# Altium project Hydrophones DAQ.PrjPcb (part 1 of 2)
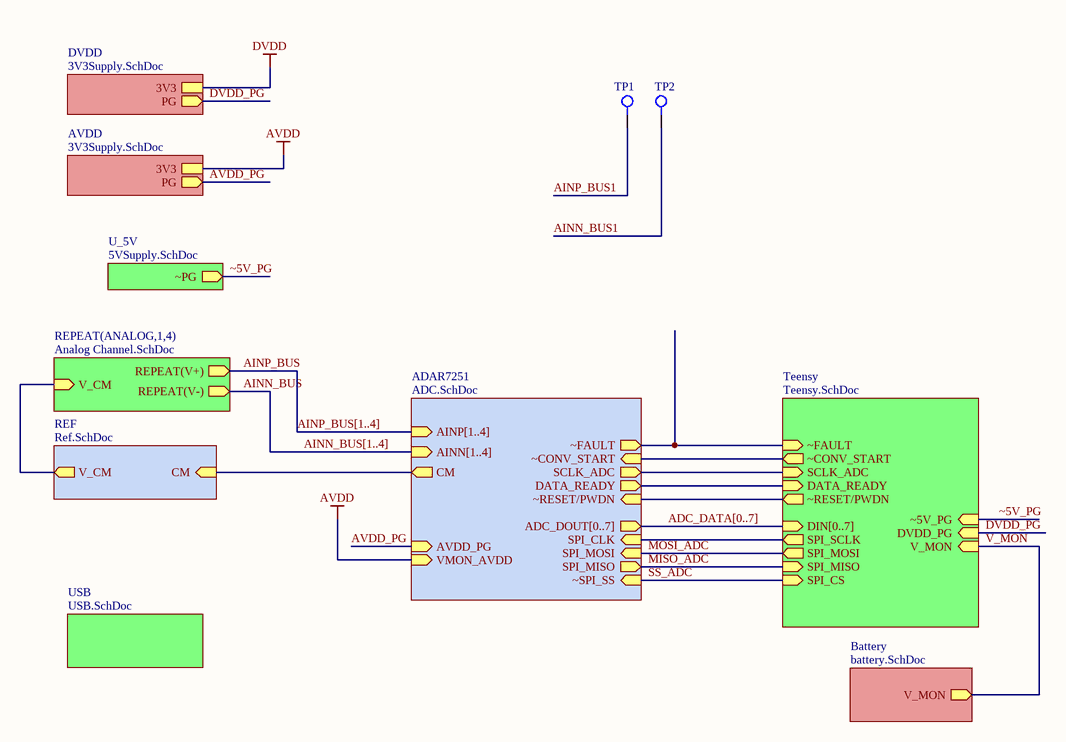
[diagram p0: Top.SchDoc]
10 sheets, 157 parts. Net scope: hierarchical (ports join the sheet entries above them; power ports are global).
Board file: Rev3.PcbDoc
Sheets:
  Top.SchDoc
    ANALOG1 = Analog Channel.SchDoc
    ANALOG2 = Analog Channel.SchDoc
    ANALOG3 = Analog Channel.SchDoc
    ANALOG4 = Analog Channel.SchDoc
    ADAR7251 = ADC.SchDoc
      XTAL = XTAL.SchDoc
    Battery = battery.SchDoc
    REF = Ref.SchDoc
    DVDD = 3V3Supply.SchDoc
    U_5V = 5VSupply.SchDoc
    AVDD = 3V3Supply.SchDoc
    Teensy = Teensy.SchDoc
    USB = USB.SchDoc

## Sheet Top.SchDoc
size A

### Parts
TP1  TP  [TP_5029]  (value not drawn)
TP2  TP  [TP_5029]  (value not drawn)

### Sub-sheets
ADAR7251 = ADC.SchDoc: AINP[1..4] (in), AINN[1..4] (in), CM (out), ADC_DOUT[0..7] (out), ~CONV_START (in), SCLK_ADC (out), ~SPI_SS (in), SPI_MISO (out), ~FAULT (out), DATA_READY (out), SPI_CLK (in), SPI_MOSI (in), ~RESET/PWDN (in), AVDD_PG (in), VMON_AVDD (in)
AVDD = 3V3Supply.SchDoc: 3V3, PG (out)
Battery = battery.SchDoc: V_MON (out)
DVDD = 3V3Supply.SchDoc: 3V3, PG (out)
REF = Ref.SchDoc: CM (in), V_CM (out)
REPEAT(ANALOG,1,4) = Analog Channel.SchDoc: REPEAT(V+) (out), REPEAT(V-) (out), V_CM (in)
Teensy = Teensy.SchDoc: SPI_MISO (in), ~FAULT (in), SCLK_ADC (in), DVDD_PG (in), ~CONV_START (out), DATA_READY (in), SPI_SCLK (out), SPI_MOSI (out), SPI_CS (in), DIN[0..7] (in), ~RESET/PWDN (out), V_MON (in), ~5V_PG (in)
U_5V = 5VSupply.SchDoc: ~PG (out)
USB = USB.SchDoc: no entries

### Nets
AVDD: sheet ADAR7251/VMON_AVDD, sheet AVDD/3V3
V_CM: sheet REPEAT(ANALOG,1,4)/V_CM, sheet REF/V_CM
AINN_BUS: sheet REPEAT(ANALOG,1,4)/REPEAT(V-)
AINN_BUS1: TP2.1
AINP_BUS: sheet REPEAT(ANALOG,1,4)/REPEAT(V+)
AINP_BUS1: TP1.1  [project net AINN1]
AVDD_PG: sheet ADAR7251/AVDD_PG, sheet AVDD/PG
CM: sheet ADAR7251/CM, sheet REF/CM
DATA_READY: sheet ADAR7251/DATA_READY, sheet Teensy/DATA_READY
DVDD_PG: sheet DVDD/PG, sheet Teensy/DVDD_PG
MISO_ADC: sheet ADAR7251/SPI_MISO, sheet Teensy/SPI_MISO
MOSI_ADC: sheet ADAR7251/SPI_MOSI, sheet Teensy/SPI_MOSI
SCLK_ADC: sheet ADAR7251/SCLK_ADC, sheet Teensy/SCLK_ADC
SPI_CLK: sheet ADAR7251/SPI_CLK, sheet Teensy/SPI_SCLK
SS_ADC: sheet ADAR7251/~SPI_SS, sheet Teensy/SPI_CS  [project net SPI_CS]
V_MON: sheet Battery/V_MON, sheet Teensy/V_MON
~5V_PG: sheet U_5V/~PG, sheet Teensy/~5V_PG
~CONV_START: sheet ADAR7251/~CONV_START, sheet Teensy/~CONV_START
~FAULT: sheet ADAR7251/~FAULT, sheet Teensy/~FAULT
~RESET/PWDN: sheet ADAR7251/~RESET/PWDN, sheet Teensy/~RESET/PWDN

### Buses and harness runs
bus ADC_DATA[0..7] = sheet ADAR7251/ADC_DOUT[0..7] = sheet Teensy/DIN[0..7]
bus AINN_BUS[1..4] = sheet ADAR7251/AINN[1..4]
bus AINP_BUS[1..4] = sheet ADAR7251/AINP[1..4]

### Library data of the parts
TP1 TP2 = TP: 5029 SMD 0805 TP; Supplier 1: Digi-Key; Supplier Part Number 1: 36-5029CT-ND

## Sheet Analog Channel.SchDoc
size A
Used 4 times, as channels ANALOG1, ANALOG2, ANALOG3, ANALOG4. Parts and nets are listed once, with the designators drawn on the sheet.
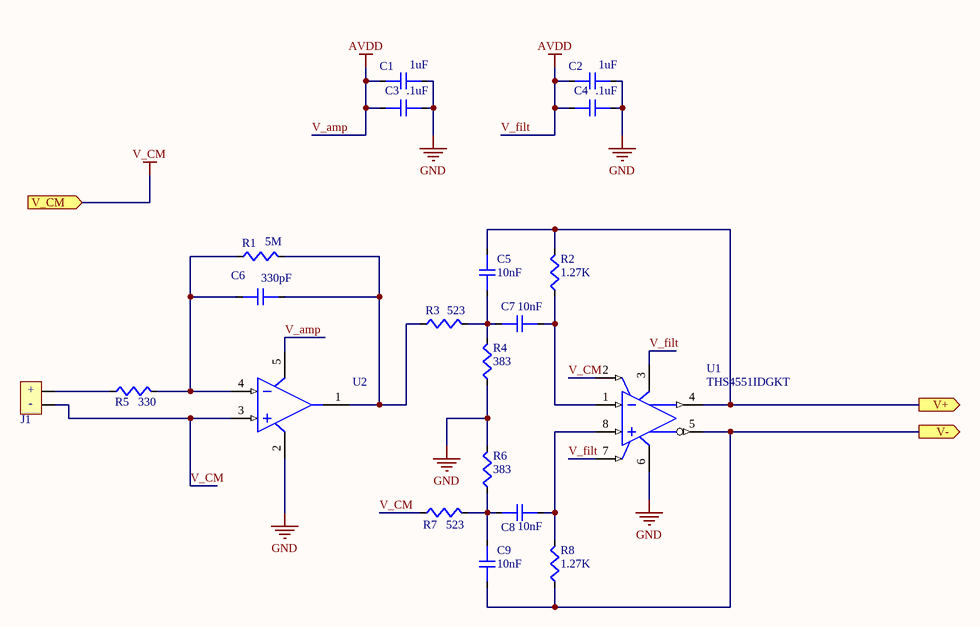
[diagram p1: Analog Channel.SchDoc]

### Parts
C1  1uF  [C0603]
C2  1uF  [C0603]
C3  .1uF  [C0603]
C4  .1uF  [C0603]
C5  10nF  [C0603]
C6  330pF  [C0603]
C7  10nF  [C0603]
C8  10nF  [C0603]
C9  10nF  [C0603]
J1  J  [EPC.00.250.NTN]  (value not drawn)
R1  5M  [R0603]
R2  1.27K  [R0603]
R3  523  [R0603]
R4  383  [R0603]
R5  330  [R0603]
R6  383  [R0603]
R7  523  [R0603]
R8  1.27K  [R0603]
U1  THS4551IDGKT  [8-VSSOP-THS4551]
U2  OPA320  [SOT-23-5]  (value not drawn)

### Ports
V+ (out), V- (out), V_CM (in)

### Nets
GND: C1.1 C2.1 C3.2 C4.2 R4.1 R6.2 U1.6(VS-) U2.2(VS-)
V_amp: C1.2 C2.2 C3.1 C4.1 U1.3(VS+) U1.7(~{PD}) U2.5(VS+)  [also labelled AVDD, V_filt]
V_CM: J1.2 R7.1 U1.2(VOCM) U2.3(+IN) ; port V_CM
V+: C5.2 R2.2 U1.4(VOUT+) ; port V+
V-: C9.1 R8.1 U1.5(VOUT-) ; port V-
NetC5_1: C5.1 C7.1 R3.2 R4.2
NetC6_1: C6.1 R1.1 R5.2 U2.4(-IN)
NetC6_2: C6.2 R1.2 R3.1 U2.1(OUT)
NetC7_2: C7.2 R2.1 U1.1(VIN-)
NetC8_1: C8.1 C9.2 R6.1 R7.2
NetC8_2: C8.2 R8.2 U1.8(VIN+)
NetJ1_1: J1.1 R5.1

### Channels
ANALOG1: designators C1=C3 C2=C29#1 C3=C2 C4=C30#1 C5=C15#1 C6=C1 C7=C25#1 C8=C14#1 C9=C13#1 J1=J1 R1=R5 R2=R25#1 R3=R9#1 R4=R21#1 R5=R1 R6=R13#1 R7=R17#1 R8=R29 U1=U5#1 U2=U1; ports V+=AINN1 V-=AINN_BUS1 V_CM=V_CM
ANALOG2: designators C1=C6 C2=C31 C3=C5 C4=C32 C5=C18#1 C6=C4 C7=C26#1 C8=C17#1 C9=C16#1 J1=J2#1 R1=R6 R2=R26#1 R3=R10#1 R4=R22#1 R5=R2 R6=R14#1 R7=R18#1 R8=R30 U1=U6#1 U2=U2; ports V+=AINN2 V-=AINN_BUS2 V_CM=V_CM
ANALOG3: designators C1=C9 C2=C33#1 C3=C8 C4=C34#1 C5=C21#1 C6=C7 C7=C27#1 C8=C20#1 C9=C19#1 J1=J3#1 R1=R7 R2=R27#1 R3=R11#1 R4=R23#1 R5=R3 R6=R15 R7=R19#1 R8=R31 U1=U7#1 U2=U3; ports V+=AINN3 V-=AINN_BUS3 V_CM=V_CM
ANALOG4: designators C1=C12#1 C2=C35#1 C3=C11#1 C4=C36#1 C5=C24#1 C6=C10#1 C7=C28#1 C8=C23#1 C9=C22#1 J1=J4#1 R1=R8 R2=R28 R3=R12#1 R4=R24#1 R5=R4 R6=R16#1 R7=R20#1 R8=R32 U1=U8#1 U2=U4; ports V+=AINN4 V-=AINN_BUS4 V_CM=V_CM

### Notes on the sheet
- (in symbol hydrophone_connector) +; -

### Library data of the parts
C1 C2 = CL10B105KO8NNNC: Cap Ceramic 1uF 16V X7R 10% SMD 0603 125C T/R; Manufacturer 1: Samsung; Supplier 1: Digi-Key; Supplier Part Number 1: 1276-1019-1-ND; Manufacturer Part Number 1: CL10B105KO8NNNC; Stock 1: 4048324; Pricing 1: 1=0.10000, 10=0.04800, 100=0.02120, 500=0.01516, 1000=0.01192 (USD); RoHS: Yes; Mount: Surface Mount; Case/Package: 0603; Case Code (Metric): 1608; Case Code (Imperial): 0603; Material: Ceramic; Min Operating Temperature: -55°C; Max Operating Temperature: 125°C; Packaging: Tape and Reel; Tolerance: 10%; Capacitance: 1uF; Voltage Rating: 16V; Dielectric: X7R; Voltage: 16V; Voltage Rating (DC): 16V; Length: 1.6mm; Height: 0.8mm; Width: 0.031inch; Thickness: 0.035inch; Depth: 0.8mm; Radiation Hardening: No; Lead Free: Lead Free; ComponentLink1URL: https://datasheet.ciiva.com/15195/getdatasheetpartid-357418-15195728.pdf?src-supplier=Verical; ComponentLink1Description: https://datasheet.ciiva.com/15195/getdatasheetpartid-357418-15195728.pdf?src-supplier=Verical; ComponentLink2URL: https://datasheet.ciiva.com/29198/458176-da-01-en-vs-kondensator-0603-29198478.pdf?src-supplier=Conrad; ComponentLink2Description: https://datasheet.ciiva.com/29198/458176-da-01-en-vs-kondensator-0603-29198478.pdf?src-supplier=Conrad
C3 C4 = VJ0603Y104JXJCW1BC: 0603 0.1 uF 16 V ±5 % Tolerance X7R SMT Multilayer Ceramic Chip Capacitor; Manufacturer 1: Vishay Vitramon; Dielectric Material: Tantalum; Tolerance: 5%; Capacitance: 100nF; Voltage Rating: 16V; Supplier 1: Digi-Key; Supplier Part Number 1: 720-1685-1-ND; Manufacturer Part Number 1: VJ0603Y104JXJCW1BC; Stock 1: 6936; Pricing 1: 1=0.20000, 10=0.13400, 100=0.06780, 500=0.04636, 1000=0.04101 (USD); RoHS: Yes; Mount: Surface Mount; Case/Package: 0603; Number of Pins: 2; Case Code (Imperial): 0603; Case Code (Metric): 1608; Contact Plating: Tin,Matte; Min Operating Temperature: -55°C; Max Operating Temperature: 125°C; Packaging: Tape and Reel; Voltage Rating (DC): 16V; Package Quantity: 4000; Dielectric: X7R; Termination: SMD/SMT; Length: 1.6mm; Height: 0.95mm; Width: 0.8mm; Depth: 0.8mm; Lead Free: Lead Free; ComponentLink1URL: https://datasheet.ciiva.com/5424/vjw1bcbascomseries-223529-5424533.pdf?src-supplier=Mouser; ComponentLink1Description: https://datasheet.ciiva.com/5424/vjw1bcbascomseries-223529-5424533.pdf?src-supplier=Mouser; ComponentLink2URL: https://datasheet.ciiva.com/11491/vjw1bcbascomseries-11491768.pdf?src-supplier=Avnet; ComponentLink2Description: https://datasheet.ciiva.com/11491/vjw1bcbascomseries-11491768.pdf?src-supplier=Avnet; ComponentLink3URL: https://datasheet.ciiva.com/16215/vjw1bcbascomseries-16215161.pdf?src-supplier=Future+Electronics; ComponentLink3Description: https://datasheet.ciiva.com/16215/vjw1bcbascomseries-16215161.pdf?src-supplier=Future+Electronics
C5 C7-C9 = C0603X103F3GACAUTO: CAP CER 10000PF 25V C0G/NP0 0603; Manufacturer 1: Murata; Manufacturer Part Number 1: GRM155R71A104JA01D; Capacitance: 100nF; Tolerance: 5%; Voltage Rating: 10V; Dielectric: X7R; Stock 1: 1113659; Pricing 1: 1=0.10000, 10=0.02800, 100=0.01240, 500=0.00886, 1000=0.00696, 2500=0.00632, 5000=0.00582 (USD); RoHS: Yes; Mount: Surface Mount; Case/Package: 0402; Case Code (Imperial): 0402; Case Code (Metric): 1005; Min Operating Temperature: -55°C; Max Operating Temperature: 125°C; Packaging: Tape and Reel; Voltage Rating (DC): 10V; Package Quantity: 10000; Termination: SMD/SMT; Length: 1mm; Height: 0.5mm; Width: 0.02inch; Thickness: 0.022inch; Depth: 0.5mm; Radiation Hardening: No; Lead Free: Lead Free; ComponentLink1URL: https://datasheet.ciiva.com/5411/product-5411135.pdf?src-supplier=Mouser; ComponentLink1Description: https://datasheet.ciiva.com/5411/product-5411135.pdf?src-supplier=Mouser; ComponentLink2URL: https://datasheet.ciiva.com/11618/c02e-11618821.pdf?src-supplier=Avnet; ComponentLink2Description: https://datasheet.ciiva.com/11618/c02e-11618821.pdf?src-supplier=Avnet; Supplier 1: Digi-Key; Supplier Part Number 1: 399-C0603X103F3GACAUTOCT-ND
C6 = CC0603KRX7R9BB331: CAP CER 330PF 50V X7R 0603; Tolerance: 10%; Insulation Resistance: 10GR; Dissipation Factor: 2.5%; RoHS: Yes; Mount: Surface Mount; Case/Package: 0603; Case Code (Imperial): 0603; Case Code (Metric): 1608; Min Operating Temperature: -55°C; Max Operating Temperature: 125°C; Capacitance: 330pF; Dielectric: X7R; Package Quantity: 1; Voltage Rating: 50V; Voltage Rating (DC): 50V; Packaging: Tape and Reel; Termination: SMD/SMT; Composition: Ceramic; Length: 1.6mm; Height: 0.8mm; Depth: 0.8mm; Width: 0.8mm; Thickness: 0.035inch; Radiation Hardening: No; REACH SVHC: Unknown; Lead Free: Lead Free; Halogen Free: Halogen Free; ComponentLink1URL: https://datasheet.ciiva.com/8033/1489800-8033879.pdf?src-supplier=Element14; ComponentLink1Description: https://datasheet.ciiva.com/8033/1489800-8033879.pdf?src-supplier=Element14; ComponentLink2URL: https://datasheet.ciiva.com/17434/upy-gphc-x7r-6-3v-to-50v-8-17434663.pdf?src-supplier=Avnet+Europe; ComponentLink2Description: https://datasheet.ciiva.com/17434/upy-gphc-x7r-6-3v-to-50v-8-17434663.pdf?src-supplier=Avnet+Europe; ComponentLink3URL: https://datasheet.ciiva.com/144/mlccorderingcode-144456.pdf?src-supplier=Digi-Key; ComponentLink3Description: https://datasheet.ciiva.com/144/mlccorderingcode-144456.pdf?src-supplier=Digi-Key; ComponentLink4URL: https://datasheet.ciiva.com/144/mlccorderingcode-144454.pdf?src-supplier=Digi-Key; ComponentLink4Description: https://datasheet.ciiva.com/144/mlccorderingcode-144454.pdf?src-supplier=Digi-Key; ComponentLink5URL: https://datasheet.ciiva.com/144/mlccorderingcode-144455.pdf?src-supplier=Digi-Key; ComponentLink5Description: https://datasheet.ciiva.com/144/mlccorderingcode-144455.pdf?src-supplier=Digi-Key; ComponentLink6URL: https://datasheet.ciiva.com/11465/upy-gphc-x7r-6-3v-to-50v-8-11465240.pdf?src-supplier=Avnet; ComponentLink6Description: https://datasheet.ciiva.com/11465/upy-gphc-x7r-6-3v-to-50v-8-11465240.pdf?src-supplier=Avnet; ComponentLink7URL: https://datasheet.ciiva.com/8033/1489800-8033881.pdf?src-supplier=Element14; ComponentLink7Description: https://datasheet.ciiva.com/8033/1489800-8033881.pdf?src-supplier=Element14; ComponentLink8URL: https://datasheet.ciiva.com/7978/1489800-7978174.pdf?src-supplier=Element14; ComponentLink8Description: https://datasheet.ciiva.com/7978/1489800-7978174.pdf?src-supplier=Element14; Supplier 1: Digi-Key; Supplier Part Number 1: 311-1186-1-ND
J1 = hydrophone_connector: Supplier 1: Digi-Key; Supplier Part Number 1: WM5378-ND; Supplier 2: Digi-Key; Supplier Part Number 2: WM8552-ND
R1 = HVC0603T5004FET: RES SMD 5M OHM 1% 1/10W 0603; Manufacturer 1: Vishay Dale; Manufacturer Part Number 1: TNPW06031K00BEEA; Resistance: 1kR; Temperature Coefficient: 25ppm/°C; Power Rating: 100mW; Voltage Rating: 75V; Stock 1: 92047; Pricing 1: 1=0.65000, 10=0.46200, 100=0.24020, 1000=0.12936, 2500=0.12760 (USD); RoHS: Yes; Mount: Surface Mount; Case/Package: 0603; Weight: 7.1E-05oz; Contact Plating: Tin; Case Code (Metric): 1608; Case Code (Imperial): 0603; Min Operating Temperature: -55°C; Max Operating Temperature: 125°C; Tolerance: 1%; Composition: Thin Film; Packaging: Tape and Reel; Package Quantity: 1; Number of Terminations: 2; Termination: SMD/SMT; Military Standard: Not; Max Power Dissipation: 100mW; Voltage Rating (DC): 75V; Features: Moisture Resistant,Automotive AEC-Q200,Anti-Sulfur; Length: 1.6mm; Height: 0.45mm; Width: 0.033inch; Depth: 0.85mm; Radiation Hardening: No; REACH SVHC: Unknown; Lead Free: Lead Free; ComponentLink1URL: https://datasheet.ciiva.com/2528/tnpw-e3-2528472.pdf?src-supplier=Digi-Key; ComponentLink1Description: https://datasheet.ciiva.com/2528/tnpw-e3-2528472.pdf?src-supplier=Digi-Key; ComponentLink2URL: https://datasheet.ciiva.com/2528/tnpw-e3-2528473.pdf?src-supplier=Digi-Key; ComponentLink2Description: https://datasheet.ciiva.com/2528/tnpw-e3-2528473.pdf?src-supplier=Digi-Key; ComponentLink3URL: https://datasheet.ciiva.com/9112/tnpw-e3-9112138.pdf?src-supplier=Avnet; ComponentLink3Description: https://datasheet.ciiva.com/9112/tnpw-e3-9112138.pdf?src-supplier=Avnet; ComponentLink4URL: https://datasheet.ciiva.com/16391/tnpw-e3-16391675.pdf?src-supplier=Future+Electronics; ComponentLink4Description: https://datasheet.ciiva.com/16391/tnpw-e3-16391675.pdf?src-supplier=Future+Electronics; ComponentLink5URL: https://datasheet.ciiva.com/9112/tnpw-e3-9112141.pdf?src-supplier=Avnet; ComponentLink5Description: https://datasheet.ciiva.com/9112/tnpw-e3-9112141.pdf?src-supplier=Avnet; ComponentLink6URL: https://datasheet.ciiva.com/16782/70201627-16782047.pdf?src-supplier=Allied+Electronics; ComponentLink6Description: https://datasheet.ciiva.com/16782/70201627-16782047.pdf?src-supplier=Allied+Electronics; Supplier 1: Digi-Key; Supplier Part Number 1: HVC0603T5004FETCT-ND
R2 R8 = 2-2176088-2: RES SMD 1.27K OHM 0.1% 1/6W 0603; Manufacturer 1: Vishay Dale; Manufacturer Part Number 1: TNPW060310K0BEEA; Resistance: 10kR; Tolerance: 1%; Temperature Coefficient: 25ppm/°C; Power Rating: 100mW; Voltage Rating: 75V; Stock 1: 296181; Pricing 1: 1=0.65000, 10=0.46200, 100=0.24020, 1000=0.12936, 2500=0.12760 (USD); RoHS: Yes; Mount: Surface Mount; Case/Package: 0603; Weight: 7.1E-05oz; Contact Plating: Tin; Case Code (Metric): 1608; Case Code (Imperial): 0603; Min Operating Temperature: -55°C; Max Operating Temperature: 125°C; Composition: Thin Film; Packaging: Tape and Reel; Package Quantity: 1; Number of Terminations: 2; Termination: SMD/SMT; Military Standard: Not; Max Power Dissipation: 100mW; Features: Moisture Resistant,Automotive AEC-Q200,Anti-Sulfur; Length: 1.6mm; Height: 0.022inch; Width: 0.033inch; Depth: 0.85mm; Radiation Hardening: No; REACH SVHC: Unknown; ComponentLink1URL: https://datasheet.ciiva.com/2483/tnpw-e3-2483253.pdf?src-supplier=Digi-Key; ComponentLink1Description: https://datasheet.ciiva.com/2483/tnpw-e3-2483253.pdf?src-supplier=Digi-Key; ComponentLink2URL: https://datasheet.ciiva.com/17190/tnpw-e3-17190917.pdf?src-supplier=Avnet+Europe; ComponentLink2Description: https://datasheet.ciiva.com/17190/tnpw-e3-17190917.pdf?src-supplier=Avnet+Europe; ComponentLink3URL: https://datasheet.ciiva.com/2483/tnpw-e3-2483254.pdf?src-supplier=Digi-Key; ComponentLink3Description: https://datasheet.ciiva.com/2483/tnpw-e3-2483254.pdf?src-supplier=Digi-Key; ComponentLink4URL: https://datasheet.ciiva.com/2483/tnpw-e3-2483255.pdf?src-supplier=Digi-Key; ComponentLink4Description: https://datasheet.ciiva.com/2483/tnpw-e3-2483255.pdf?src-supplier=Digi-Key; ComponentLink5URL: https://datasheet.ciiva.com/16335/tnpw-e3-16335132.pdf?src-supplier=Future+Electronics; ComponentLink5Description: https://datasheet.ciiva.com/16335/tnpw-e3-16335132.pdf?src-supplier=Future+Electronics; ComponentLink6URL: https://datasheet.ciiva.com/28589/1912606-28589004.pdf?src-supplier=Element14; ComponentLink6Description: https://datasheet.ciiva.com/28589/1912606-28589004.pdf?src-supplier=Element14; ComponentLink7URL: https://datasheet.ciiva.com/7792/tnpw-e3-7792477.pdf?src-supplier=Element14; ComponentLink7Description: https://datasheet.ciiva.com/7792/tnpw-e3-7792477.pdf?src-supplier=Element14; ComponentLink8URL: https://datasheet.ciiva.com/9050/tnpw-e3-9050974.pdf?src-supplier=Avnet; ComponentLink8Description: https://datasheet.ciiva.com/9050/tnpw-e3-9050974.pdf?src-supplier=Avnet; Supplier 1: Digi-Key; Supplier Part Number 1: A110118CT-ND
R3 R7 = RP73PF1J523RBTDF: RES SMD 523 OHM 0.1% 1/6W 0603; Manufacturer 1: Vishay Dale; Manufacturer Part Number 1: TNPW060310K0BEEA; Resistance: 10kR; Tolerance: 1%; Temperature Coefficient: 25ppm/°C; Power Rating: 100mW; Voltage Rating: 75V; Stock 1: 296181; Pricing 1: 1=0.65000, 10=0.46200, 100=0.24020, 1000=0.12936, 2500=0.12760 (USD); RoHS: Yes; Mount: Surface Mount; Case/Package: 0603; Weight: 7.1E-05oz; Contact Plating: Tin; Case Code (Metric): 1608; Case Code (Imperial): 0603; Min Operating Temperature: -55°C; Max Operating Temperature: 125°C; Composition: Thin Film; Packaging: Tape and Reel; Package Quantity: 1; Number of Terminations: 2; Termination: SMD/SMT; Military Standard: Not; Max Power Dissipation: 100mW; Features: Moisture Resistant,Automotive AEC-Q200,Anti-Sulfur; Length: 1.6mm; Height: 0.022inch; Width: 0.033inch; Depth: 0.85mm; Radiation Hardening: No; REACH SVHC: Unknown; ComponentLink1URL: https://datasheet.ciiva.com/2483/tnpw-e3-2483253.pdf?src-supplier=Digi-Key; ComponentLink1Description: https://datasheet.ciiva.com/2483/tnpw-e3-2483253.pdf?src-supplier=Digi-Key; ComponentLink2URL: https://datasheet.ciiva.com/17190/tnpw-e3-17190917.pdf?src-supplier=Avnet+Europe; ComponentLink2Description: https://datasheet.ciiva.com/17190/tnpw-e3-17190917.pdf?src-supplier=Avnet+Europe; ComponentLink3URL: https://datasheet.ciiva.com/2483/tnpw-e3-2483254.pdf?src-supplier=Digi-Key; ComponentLink3Description: https://datasheet.ciiva.com/2483/tnpw-e3-2483254.pdf?src-supplier=Digi-Key; ComponentLink4URL: https://datasheet.ciiva.com/2483/tnpw-e3-2483255.pdf?src-supplier=Digi-Key; ComponentLink4Description: https://datasheet.ciiva.com/2483/tnpw-e3-2483255.pdf?src-supplier=Digi-Key; ComponentLink5URL: https://datasheet.ciiva.com/16335/tnpw-e3-16335132.pdf?src-supplier=Future+Electronics; ComponentLink5Description: https://datasheet.ciiva.com/16335/tnpw-e3-16335132.pdf?src-supplier=Future+Electronics; ComponentLink6URL: https://datasheet.ciiva.com/28589/1912606-28589004.pdf?src-supplier=Element14; ComponentLink6Description: https://datasheet.ciiva.com/28589/1912606-28589004.pdf?src-supplier=Element14; ComponentLink7URL: https://datasheet.ciiva.com/7792/tnpw-e3-7792477.pdf?src-supplier=Element14; ComponentLink7Description: https://datasheet.ciiva.com/7792/tnpw-e3-7792477.pdf?src-supplier=Element14; ComponentLink8URL: https://datasheet.ciiva.com/9050/tnpw-e3-9050974.pdf?src-supplier=Avnet; ComponentLink8Description: https://datasheet.ciiva.com/9050/tnpw-e3-9050974.pdf?src-supplier=Avnet; Supplier 1: Digi-Key; Supplier Part Number 1: A110081CT-ND
R4 R6 = RP73PF1J383RBTDF: RES SMD 383 OHM ±0.1% 0.167W, 1/6W Chip Resistor 0603 (1608 Metric) - Thin Film; Manufacturer 1: Vishay Dale; Manufacturer Part Number 1: TNPW060310K0BEEA; Resistance: 10kR; Tolerance: 1%; Temperature Coefficient: 25ppm/°C; Power Rating: 100mW; Voltage Rating: 75V; Stock 1: 296181; Pricing 1: 1=0.65000, 10=0.46200, 100=0.24020, 1000=0.12936, 2500=0.12760 (USD); RoHS: Yes; Mount: Surface Mount; Case/Package: 0603; Weight: 7.1E-05oz; Contact Plating: Tin; Case Code (Metric): 1608; Case Code (Imperial): 0603; Min Operating Temperature: -55°C; Max Operating Temperature: 125°C; Composition: Thin Film; Packaging: Tape and Reel; Package Quantity: 1; Number of Terminations: 2; Termination: SMD/SMT; Military Standard: Not; Max Power Dissipation: 100mW; Features: Moisture Resistant,Automotive AEC-Q200,Anti-Sulfur; Length: 1.6mm; Height: 0.022inch; Width: 0.033inch; Depth: 0.85mm; Radiation Hardening: No; REACH SVHC: Unknown; ComponentLink1URL: https://datasheet.ciiva.com/2483/tnpw-e3-2483253.pdf?src-supplier=Digi-Key; ComponentLink1Description: https://datasheet.ciiva.com/2483/tnpw-e3-2483253.pdf?src-supplier=Digi-Key; ComponentLink2URL: https://datasheet.ciiva.com/17190/tnpw-e3-17190917.pdf?src-supplier=Avnet+Europe; ComponentLink2Description: https://datasheet.ciiva.com/17190/tnpw-e3-17190917.pdf?src-supplier=Avnet+Europe; ComponentLink3URL: https://datasheet.ciiva.com/2483/tnpw-e3-2483254.pdf?src-supplier=Digi-Key; ComponentLink3Description: https://datasheet.ciiva.com/2483/tnpw-e3-2483254.pdf?src-supplier=Digi-Key; ComponentLink4URL: https://datasheet.ciiva.com/2483/tnpw-e3-2483255.pdf?src-supplier=Digi-Key; ComponentLink4Description: https://datasheet.ciiva.com/2483/tnpw-e3-2483255.pdf?src-supplier=Digi-Key; ComponentLink5URL: https://datasheet.ciiva.com/16335/tnpw-e3-16335132.pdf?src-supplier=Future+Electronics; ComponentLink5Description: https://datasheet.ciiva.com/16335/tnpw-e3-16335132.pdf?src-supplier=Future+Electronics; ComponentLink6URL: https://datasheet.ciiva.com/28589/1912606-28589004.pdf?src-supplier=Element14; ComponentLink6Description: https://datasheet.ciiva.com/28589/1912606-28589004.pdf?src-supplier=Element14; ComponentLink7URL: https://datasheet.ciiva.com/7792/tnpw-e3-7792477.pdf?src-supplier=Element14; ComponentLink7Description: https://datasheet.ciiva.com/7792/tnpw-e3-7792477.pdf?src-supplier=Element14; ComponentLink8URL: https://datasheet.ciiva.com/9050/tnpw-e3-9050974.pdf?src-supplier=Avnet; ComponentLink8Description: https://datasheet.ciiva.com/9050/tnpw-e3-9050974.pdf?src-supplier=Avnet; Supplier 1: Digi-Key; Supplier Part Number 1: A110068CT-ND
R5 = MCT06030C3300FP500: RES SMD 330 OHM 1% 1/8W 0603; Manufacturer 1: Vishay Beyschlag; Resistance: 330R; Power Rating: 125mW; Voltage Rating: 75V; Temperature Coefficient: 50ppm/°C; Supplier 1: Digi-Key; Supplier Part Number 1: MCT0603-330-CFCT-ND; Manufacturer Part Number 1: MCT06030C3300FP500; Stock 1: 133742; Pricing 1: 1=0.18000, 10=0.15200, 100=0.05960, 1000=0.02495, 2500=0.02287 (USD); RoHS: Yes; Case/Package: 0603; Case Code (Metric): 1608; Case Code (Imperial): 0603; Contact Plating: Tin; Min Operating Temperature: -55°C; Max Operating Temperature: 125°C; Package Quantity: 1; Tolerance: 1%; Packaging: Tape and Reel; Composition: Thin Film; Number of Terminations: 2; Military Standard: Not; Max Power Dissipation: 125mW; Voltage Rating (DC): 75V; Length: 0.061inch; Height: 0.022inch; Width: 0.033inch; Depth: 0.85mm; Radiation Hardening: No; REACH SVHC: No SVHC; Lead Free: Lead Free; ComponentLink1URL: https://datasheet.ciiva.com/2470/mc-pro-2470441.pdf?src-supplier=Digi-Key; ComponentLink1Description: https://datasheet.ciiva.com/2470/mc-pro-2470441.pdf?src-supplier=Digi-Key; ComponentLink2URL: https://datasheet.ciiva.com/2470/mc-pro-2470442.pdf?src-supplier=Digi-Key; ComponentLink2Description: https://datasheet.ciiva.com/2470/mc-pro-2470442.pdf?src-supplier=Digi-Key; ComponentLink3URL: https://datasheet.ciiva.com/2470/mc-pro-2470443.pdf?src-supplier=Digi-Key; ComponentLink3Description: https://datasheet.ciiva.com/2470/mc-pro-2470443.pdf?src-supplier=Digi-Key; ComponentLink4URL: https://datasheet.ciiva.com/16892/mc-pro-16892683.pdf?src-supplier=Avnet+Europe; ComponentLink4Description: https://datasheet.ciiva.com/16892/mc-pro-16892683.pdf?src-supplier=Avnet+Europe; ComponentLink5URL: https://datasheet.ciiva.com/8898/mc-pro-8898943.pdf?src-supplier=Avnet; ComponentLink5Description: https://datasheet.ciiva.com/8898/mc-pro-8898943.pdf?src-supplier=Avnet
U1 = THS4551IDGKT: Low Noise, Precision, 150MHz, Fully Differential Amplifier 8-VSSOP -40 to 125; Manufacturer 1: Texas Instruments; Number of Channels: 1; Slew Rate: 220V/µs; Output Current per Channel: 65mA; Gain Bandwidth Product: 135MHz; Input Bias Current: 1uA; Input Offset Voltage (Vos): 50uV; Operating Supply Current: 1.35mA; Supplier 1: Digi-Key; Supplier Part Number 1: 296-44771-1-ND; Manufacturer Part Number 1: THS4551IDGKT; Stock 1: 3028; Pricing 1: 1=3.84000, 10=3.44900, 100=2.82600 (USD); Mount: Surface Mount; Case/Package: VSSOP; Number of Pins: 8; Min Operating Temperature: -40°C; Max Operating Temperature: 125°C; -3db Bandwidth: 150MHz; Packaging: Cut Tape; Number of Circuits: 1; Number of Amplifiers: 1; Bandwidth: 135MHz; REACH SVHC: No SVHC; Lead Free: Lead Free; ComponentLink1URL: http://www.ti.com/lit/ds/symlink/ths4551.pdf?src-supplier=Digi-Key; ComponentLink1Description: http://www.ti.com/lit/ds/symlink/ths4551.pdf?src-supplier=Digi-Key; ComponentLink2URL: http://www.ti.com/general/docs/lit/getliterature.tsp?genericPartNumber=THS4551&fileType=pdf&src-supplier=Farnell; ComponentLink2Description: http://www.ti.com/general/docs/lit/getliterature.tsp?genericPartNumber=THS4551&fileType=pdf&src-supplier=Farnell; ComponentLink3URL: http://www.farnell.com/datasheets/2148327.pdf?src-supplier=Element14; ComponentLink3Description: http://www.farnell.com/datasheets/2148327.pdf?src-supplier=Element14; ComponentLink4URL: https://octopart.com/click/track?ai=2118&ct=datasheets&sig=0013830&at=physicalpart&sid=370&ppid=71776714&hlid=24961842&src-supplier=TI+store; ComponentLink4Description: https://octopart.com/click/track?ai=2118&ct=datasheets&sig=0013830&at=physicalpart&sid=370&ppid=71776714&hlid=24961842&src-supplier=TI+store; ComponentLink5URL: http://sigma.octopart.com/49250154/technical_drawing/Texas-Instruments-THS4551IDGKT.pdf?src-supplier=TI+store; ComponentLink5Description: http://sigma.octopart.com/49250154/technical_drawing/Texas-Instruments-THS4551IDGKT.pdf?src-supplier=TI+store; ComponentLink6URL: http://datasheet.octopart.com/THS4551IDGKT-Texas-Instruments-datasheet-78835010.pdf?src-supplier=Element14; ComponentLink6Description: http://datasheet.octopart.com/THS4551IDGKT-Texas-Instruments-datasheet-78835010.pdf?src-supplier=Element14; ComponentLink7URL: http://datasheet.octopart.com/THS4551IDGKT-Texas-Instruments-datasheet-67294894.pdf?src-supplier=Newark; ComponentLink7Description: http://datasheet.octopart.com/THS4551IDGKT-Texas-Instruments-datasheet-67294894.pdf?src-supplier=Newark; RoHS: No; ComponentLink8URL: https://www.te.com/commerce/DocumentDelivery/DDEController?Action=srchrtrv&DocNm=1773204-3&DocType=DS&DocLang=English&src-supplier=Digi-Key; ComponentLink8Description: https://www.te.com/commerce/DocumentDelivery/DDEController?Action=srchrtrv&DocNm=1773204-3&DocType=DS&DocLang=English&src-supplier=Digi-Key; ComponentLink9URL: https://www.te.com/commerce/DocumentDelivery/DDEController?Action=srchrtrv&amp;DocNm=1773204-3&amp;DocType=DS&amp;DocLang=English&src-supplier=Digi-Key; ComponentLink9Description: https://www.te.com/commerce/DocumentDelivery/DDEController?Action=srchrtrv&amp;DocNm=1773204-3&amp;DocType=DS&amp;DocLang=English&src-supplier=Digi-Key
U2 = OPA320AQDBVRQ1: General Purpose Amplifier Circuit Rail-to-Rail SOT-23-5; Manufacturer 1: Texas Instruments; Manufacturer Part Number 1: OPA325IDBVR; Supplier 1: Digi-Key; Supplier Part Number 1: 296-OPA325IDBVRCT-ND; Stock 1: 2034; Pricing 1: 1=1.69000, 10=1.51600, 25=1.43000, 100=1.14400, 250=1.00100, 500=0.97240, 1000=0.77220 (USD); RoHS: No

## Sheet ADC.SchDoc
size A
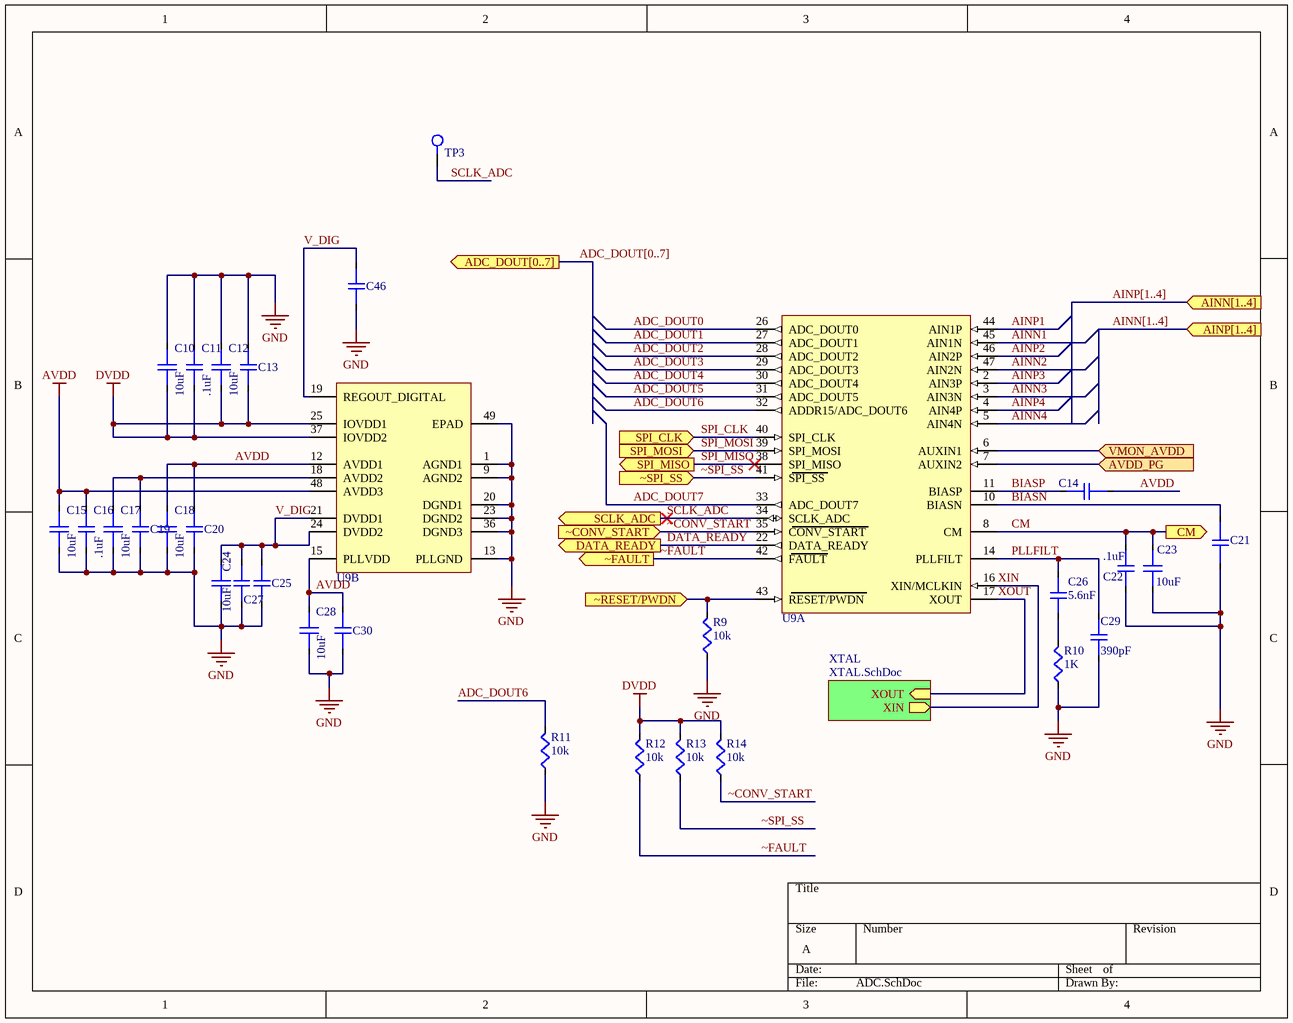
[diagram p2: ADC.SchDoc]

### Parts
(Parts that share a designator on the sheet are numbered #1, #2 ... from top to bottom, then left to right.)
C10#2  10uF  [C0805]
C11#2  .1uF  [C0603]
C12#2  10uF  [C0805]
C13#2  .1uF  [C0402]  (value not drawn)
C14#2  .47uF  [C0603]  (value not drawn)
C15#2  10uF  [C0805]
C16#2  .1uF  [C0603]
C17#2  10uF  [C0805]
C18#2  10uF  [C0805]
C19#2  .1uF  [C0402]  (value not drawn)
C20#2  .1uF  [C0402]  (value not drawn)
C21#2  .47uF  [C0603]  (value not drawn)
C22#2  .1uF  [C0402]
C23#2  10uF  [C0805]
C24#2  10uF  [C0805]
C25#2  .1uF  [C0402]  (value not drawn)
C26#2  5.6nF  [C0402]
C27#2  .1uF  [C0402]  (value not drawn)
C28#2  10uF  [C0805]
C29#2  390pF  [c0402]
C30#2  .1uF  [C0402]  (value not drawn)
C46  .1uF  [C0402]  (value not drawn)
R9#2  10k  [R0603]
R10#2  1K  [R0603]
R11#2  10k  [R0603]
R12#2  10k  [R0603]
R13#2  10k  [R0603]
R14#2  10k  [R0603]
TP3  TP  [TP_5029]  (value not drawn)
U9  15  [QFN50P700X700X75-49N]  (value not drawn)  (parts A,B of 2)

### Sub-sheets
XTAL = XTAL.SchDoc: XIN (out), XOUT (in)

### Ports
ADC_DOUT[0..7] (out), AINN[1..4] (in), AINP[1..4] (in), AVDD_PG (in), CM (out), DATA_READY (out), SCLK_ADC (out), SPI_CLK (in), SPI_MISO (out), SPI_MOSI (in), VMON_AVDD (in), ~CONV_START (in), ~FAULT (out), ~RESET/PWDN (in), ~SPI_SS (in)

### Nets
AVDD: C14#2.2 C15#2.2 C16#2.1 C18#2.2 C20#2.1 C28#2.2 C30#2.2 U9.6(AUXIN1) U9.12(AVDD1) U9.15(PLLVDD) U9.48(AVDD3) ; port VMON_AVDD
DVDD: C10#2.1 C11#2.2 C12#2.1 C13#2.2 R12#2.2 R13#2.2 R14#2.2 U9.25(IOVDD1) U9.37(IOVDD2)
GND: C10#2.2 C11#2.1 C12#2.2 C13#2.1 C15#2.1 C16#2.2 C17#2.1 C18#2.1 C19#2.2 C20#2.2 C21#2.2 C22#2.1 C23#2.1 C24#2.1 C25#2.1 C27#2.1 C28#2.1 C29#2.1 C30#2.1 C46.1 R9#2.1 R10#2.1 R11#2.1 U9.1(AGND1) U9.9(AGND2) U9.13(PLLGND) U9.20(DGND1) U9.23(DGND2) U9.36(DGND3) U9.49(EPAD)
ADC_DOUT0: U9.26(ADC_DOUT0)  [project net ADC_DATA0]
ADC_DOUT1: U9.27(ADC_DOUT1)  [project net ADC_DATA1]
ADC_DOUT2: U9.28(ADC_DOUT2)  [project net ADC_DATA2]
ADC_DOUT3: U9.29(ADC_DOUT3)  [project net ADC_DATA3]
ADC_DOUT4: U9.30(ADC_DOUT4)  [project net ADC_DATA4]
ADC_DOUT5: U9.31(ADC_DOUT5)  [project net ADC_DATA5]
ADC_DOUT6: R11#2.2 U9.32(ADDR15/ADC_DOUT6)  [project net ADC_DATA6]
ADC_DOUT7: U9.33(ADC_DOUT7)  [project net ADC_DATA7]
AINN1: U9.45(AIN1N)
AINN2: U9.47(AIN2N)
AINN3: U9.3(AIN3N)
AINN4: U9.5(AIN4N)
AINP1: U9.44(AIN1P)  [project net AINN_BUS1]
AINP2: U9.46(AIN2P)  [project net AINN_BUS2]
AINP3: U9.2(AIN3P)  [project net AINN_BUS3]
AINP4: U9.4(AIN4P)  [project net AINN_BUS4]
AVDD_PG: U9.7(AUXIN2) ; port AVDD_PG
BIASN: C21#2.1 U9.10(BIASN)
BIASP: C14#2.1 U9.11(BIASP)
CM: C22#2.2 C23#2.2 U9.8(CM) ; port CM
DATA_READY: U9.22(DATA_READY) ; port DATA_READY
PLLFILT: C26#2.2 C29#2.2 U9.14(PLLFILT)
SCLK_ADC: TP3.1 U9.34(SCLK_ADC) ; port SCLK_ADC
SPI_CLK: U9.40(SPI_CLK) ; port SPI_CLK
SPI_MISO: U9.38(SPI_MISO) ; port SPI_MISO  [project net MISO_ADC]
SPI_MOSI: U9.39(SPI_MOSI) ; port SPI_MOSI  [project net MOSI_ADC]
V_DIG: C24#2.2 C25#2.2 C27#2.2 C46.2 U9.19(REGOUT_DIGITAL) U9.21(DVDD1) U9.24(DVDD2)
XIN: U9.16(XIN/MCLKIN) ; sheet XTAL/XIN
XOUT: U9.17(XOUT) ; sheet XTAL/XOUT
~CONV_START: R14#2.1 U9.35(CONV_START) ; port ~CONV_START
~FAULT: R12#2.1 U9.42(FAULT) ; port ~FAULT
~RESET/PWDN: R9#2.2 U9.43(RESET/PWDN) ; port ~RESET/PWDN
~SPI_SS: R13#2.1 U9.41(SPI_SS) ; port ~SPI_SS  [project net SPI_CS]
NetC17#2_2: C17#2.2 C19#2.1 U9.18(AVDD2)
NetC26#2_1: C26#2.1 R10#2.2

### Buses and harness runs
bus ADC_DOUT[0..7] = port ADC_DOUT[0..7]
bus AINN[1..4] = port AINP[1..4]
bus AINP[1..4] = port AINN[1..4]

### Library data of the parts
C10#2 C12#2 C15#2 C17#2 C18#2 C23#2 C24#2 C28#2 = GCM21BR71A106KE22K: CAP CER 10UF 10V X7R 0805; Manufacturer 1: Murata; Tolerance: 10%; Supplier 1: Digi-Key; Supplier Part Number 1: 490-14531-1-ND; Manufacturer Part Number 1: GCM21BR71A106KE22K; Stock 1: 78878; Pricing 1: 1=0.57000, 10=0.40300, 100=0.26540, 500=0.19658, 1000=0.16709, 2500=0.15726, 5000=0.14744 (USD); RoHS: Yes; Mount: Surface Mount; Case/Package: 0805; Weight: 0.000335oz; Case Code (Imperial): 0805; Case Code (Metric): 2012; Min Operating Temperature: -55°C; Max Operating Temperature: 125°C; Packaging: Tape and Reel; Capacitance: 10uF; Voltage Rating: 10V; Dielectric: X7R; Termination: SMD/SMT; Voltage Rating (DC): 10V; Package Quantity: 10000; Length: 0.079inch; Height: 1.25mm; Width: 1.25mm; Thickness: 0.055inch; Ratings: AEC-Q200; ComponentLink1URL: http://www.mouser.com/ds/2/281/c03e-806517.pdf?src-supplier=Mouser; ComponentLink1Description: http://www.mouser.com/ds/2/281/c03e-806517.pdf?src-supplier=Mouser; ComponentLink2URL: http://search.murata.co.jp/Ceramy/image/img/A01X/G101/ENG/GCM21BR71A106KE22-01.pdf?src-supplier=Digi-Key; ComponentLink2Description: http://search.murata.co.jp/Ceramy/image/img/A01X/G101/ENG/GCM21BR71A106KE22-01.pdf?src-supplier=Digi-Key; ComponentLink3URL: http://search.murata.co.jp/Ceramy/image/img/A01X/partnumbering_e_02.pdf?src-supplier=Digi-Key; ComponentLink3Description: http://search.murata.co.jp/Ceramy/image/img/A01X/partnumbering_e_02.pdf?src-supplier=Digi-Key
C11#2 C16#2 = VJ0603Y104JXJCW1BC: as C3 on sheet Analog Channel; Supplier 1: Digi-Key; Supplier Part Number 1: 720-1685-1-ND; Manufacturer Part Number 1: VJ0603Y104JXJCW1BC; Stock 1: 6936; Pricing 1: 1=0.20000, 10=0.13400, 100=0.06780, 500=0.04636, 1000=0.04101 (USD); RoHS: Yes; Mount: Surface Mount; Case/Package: 0603; Number of Pins: 2; Case Code (Imperial): 0603; Case Code (Metric): 1608; Contact Plating: Tin,Matte; Min Operating Temperature: -55°C; Max Operating Temperature: 125°C; Packaging: Tape and Reel; Voltage Rating (DC): 16V; Package Quantity: 4000; Dielectric: X7R; Termination: SMD/SMT; Length: 1.6mm; Height: 0.95mm; Width: 0.8mm; Depth: 0.8mm; Lead Free: Lead Free; ComponentLink1URL: https://datasheet.ciiva.com/5424/vjw1bcbascomseries-223529-5424533.pdf?src-supplier=Mouser; ComponentLink1Description: https://datasheet.ciiva.com/5424/vjw1bcbascomseries-223529-5424533.pdf?src-supplier=Mouser; ComponentLink2URL: https://datasheet.ciiva.com/11491/vjw1bcbascomseries-11491768.pdf?src-supplier=Avnet; ComponentLink2Description: https://datasheet.ciiva.com/11491/vjw1bcbascomseries-11491768.pdf?src-supplier=Avnet; ComponentLink3URL: https://datasheet.ciiva.com/16215/vjw1bcbascomseries-16215161.pdf?src-supplier=Future+Electronics; ComponentLink3Description: https://datasheet.ciiva.com/16215/vjw1bcbascomseries-16215161.pdf?src-supplier=Future+Electronics
C13#2 C19#2 C20#2 C22#2 C25#2 C27#2 C30#2 C46 = GRM155R71A104JA01D: 0402 0.1 uF 10 V ±5% Tolerance X7R SMT Multilayer Ceramic Capacitor; Manufacturer 1: Murata; Capacitance: 100nF; Voltage Rating: 10V; Supplier 1: Digi-Key; Supplier Part Number 1: 490-10777-1-ND; Manufacturer Part Number 1: GRM155R71A104JA01D; Stock 1: 1113659; Pricing 1: 1=0.10000, 10=0.02800, 100=0.01240, 500=0.00886, 1000=0.00696, 2500=0.00632, 5000=0.00582 (USD); RoHS: Yes; Mount: Surface Mount; Case/Package: 0402; Case Code (Imperial): 0402; Case Code (Metric): 1005; Min Operating Temperature: -55°C; Max Operating Temperature: 125°C; Tolerance: 5%; Packaging: Tape and Reel; Voltage Rating (DC): 10V; Package Quantity: 10000; Dielectric: X7R; Termination: SMD/SMT; Length: 1mm; Height: 0.5mm; Width: 0.02inch; Depth: 0.5mm; Lead Free: Lead Free; ComponentLink1URL: https://datasheet.ciiva.com/5411/product-5411135.pdf?src-supplier=Mouser; ComponentLink1Description: https://datasheet.ciiva.com/5411/product-5411135.pdf?src-supplier=Mouser; ComponentLink2URL: https://datasheet.ciiva.com/11618/c02e-11618821.pdf?src-supplier=Avnet; ComponentLink2Description: https://datasheet.ciiva.com/11618/c02e-11618821.pdf?src-supplier=Avnet; Thickness: 0.022inch; Radiation Hardening: No
C14#2 C21#2 = C0603C474J4RACAUTO: KEMET - C0603C474J4RACAUTO - CAP, 0.47µF, 16V, 5%, X7R, 0603; Capacitance: 470nF; Supplier 1: Digi-Key; Supplier Part Number 1: 399-17596-1-ND; Manufacturer 1: KEMET; Manufacturer Part Number 1: C0603C474J4RACAUTO; Stock 1: 10040; Pricing 1: 1=0.51000, 10=0.35800, 100=0.23570, 500=0.17462, 1000=0.14842 (USD); RoHS: Yes; Case/Package: 0603; Min Operating Temperature: -55°C; Max Operating Temperature: 125°C; Tolerance: 5%; Packaging: Tape and Reel; Dielectric: X7R; Length: 1.6mm; Depth: 0.8mm; ComponentLink1URL: http://www.farnell.com/datasheets/2749769.pdf?src-supplier=Farnell; ComponentLink1Description: http://www.farnell.com/datasheets/2749769.pdf?src-supplier=Farnell; ComponentLink2URL: http://components.arrow.com/part/dataview/0323_07310140?src-supplier=Arrow+Europe; ComponentLink2Description: http://components.arrow.com/part/dataview/0323_07310140?src-supplier=Arrow+Europe; ComponentLink3URL: https://api.kemet.com/component-edge/download/datasheet/C0603C474J4RACAUTO.pdf?src-supplier=Digi-Key; ComponentLink3Description: https://api.kemet.com/component-edge/download/datasheet/C0603C474J4RACAUTO.pdf?src-supplier=Digi-Key; ComponentLink4URL: http://www.farnell.com/datasheets/2749769.pdf?src-supplier=Element14; ComponentLink4Description: http://www.farnell.com/datasheets/2749769.pdf?src-supplier=Element14; ComponentLink5URL: http://www.farnell.com/datasheets/2749769.pdf?src-supplier=Newark; ComponentLink5Description: http://www.farnell.com/datasheets/2749769.pdf?src-supplier=Newark
C26#2 = 04025C562JAT2A: Multilayer Ceramic Capacitors MLCC - SMD/SMT 50volts 5600pF 5% C0G; Voltage Rating (DC): 50V; Temperature Coefficient: 30ppm/°C; Dissipation Factor: 0.1%; Supplier 1: Digi-Key; Supplier Part Number 1: 478-10129-1-ND; RoHS: Yes; Mount: Surface Mount; Case/Package: 0603; Number of Pins: 2; Dielectric Material: Ceramic; Case Code (Metric): 1608; Case Code (Imperial): 0603; Min Operating Temperature: -55°C; Max Operating Temperature: 125°C; Capacitance: 5.6nF; Tolerance: 5%; Dielectric: C0G; Package Quantity: 4000; Voltage Rating: 50V; Packaging: Tape and Reel; Termination: SMD/SMT; Voltage: 50V; Length: 1.6mm; Height: 0.8mm; Width: 0.031inch; Thickness: 0.034inch; Depth: 0.8mm; Radiation Hardening: No; Lead Free: Lead Free; REACH SVHC: No SVHC; ComponentLink1URL: https://datasheet.ciiva.com/28608/1372242-28608633.pdf?src-supplier=Element14; ComponentLink1Description: https://datasheet.ciiva.com/28608/1372242-28608633.pdf?src-supplier=Element14; ComponentLink2URL: https://datasheet.ciiva.com/22705/40889-22705450.pdf?src-supplier=Element14; ComponentLink2Description: https://datasheet.ciiva.com/22705/40889-22705450.pdf?src-supplier=Element14; ComponentLink3URL: https://datasheet.ciiva.com/26847/getdatasheetpartid-385577-26847722.pdf?src-supplier=Verical; ComponentLink3Description: https://datasheet.ciiva.com/26847/getdatasheetpartid-385577-26847722.pdf?src-supplier=Verical; ComponentLink4URL: https://datasheet.ciiva.com/7823/40889-7823822.pdf?src-supplier=Element14; ComponentLink4Description: https://datasheet.ciiva.com/7823/40889-7823822.pdf?src-supplier=Element14; ComponentLink5URL: https://datasheet.ciiva.com/5448/kem-c1003-c0g-smd-356956-5448159.pdf?src-supplier=Mouser; ComponentLink5Description: https://datasheet.ciiva.com/5448/kem-c1003-c0g-smd-356956-5448159.pdf?src-supplier=Mouser
C29#2 = 04025C391JAT2A: CAP CER 390PF 50V C0G/NP0 0603; Dielectric Material: Ceramic; Tolerance: 5%; Dielectric: C0G; Dissipation Factor: 0.1%; Temperature Coefficient: 30ppm/°C; Supplier 1: Digi-Key; Supplier Part Number 1: 478-5269-1-ND; RoHS: Yes; Mount: Surface Mount,PCB; Case/Package: 0603; Number of Pins: 2; Case Code (Metric): 1608; Case Code (Imperial): 0603; Min Operating Temperature: -55°C; Max Operating Temperature: 125°C; Capacitance: 390pF; Voltage Rating (DC): 50V; Packaging: Tape and Reel; Package Quantity: 1; Voltage Rating: 50V; Termination: SMD/SMT; Voltage: 50V; Length: 1.6mm; Height: 0.8mm; Depth: 0.8mm; Width: 0.8mm; Thickness: 0.034inch; Lead Pitch: 0.7mm; Radiation Hardening: No; Lead Free: Lead Free; REACH SVHC: No SVHC; ComponentLink1URL: https://datasheet.ciiva.com/144/docfinderpartnumber-c0603c391j5gactu-144833.pdf?src-supplier=Digi-Key; ComponentLink1Description: https://datasheet.ciiva.com/144/docfinderpartnumber-c0603c391j5gactu-144833.pdf?src-supplier=Digi-Key; ComponentLink2URL: https://datasheet.ciiva.com/7823/40889-7823769.pdf?src-supplier=Element14; ComponentLink2Description: https://datasheet.ciiva.com/7823/40889-7823769.pdf?src-supplier=Element14; ComponentLink3URL: https://datasheet.ciiva.com/7823/40889-7823770.pdf?src-supplier=Element14; ComponentLink3Description: https://datasheet.ciiva.com/7823/40889-7823770.pdf?src-supplier=Element14; ComponentLink4URL: https://datasheet.ciiva.com/5415/kem-c1003-c0g-smd-356956-5415640.pdf?src-supplier=Mouser; ComponentLink4Description: https://datasheet.ciiva.com/5415/kem-c1003-c0g-smd-356956-5415640.pdf?src-supplier=Mouser; ComponentLink5URL: https://datasheet.ciiva.com/18102/getdatasheetpartid-77374-18102795.pdf?src-supplier=Verical; ComponentLink5Description: https://datasheet.ciiva.com/18102/getdatasheetpartid-77374-18102795.pdf?src-supplier=Verical; ComponentLink6URL: https://datasheet.ciiva.com/18219/getdatasheetpartid-385544-18219227.pdf?src-supplier=Verical; ComponentLink6Description: https://datasheet.ciiva.com/18219/getdatasheetpartid-385544-18219227.pdf?src-supplier=Verical
R9#2 R11#2 R12#2 R13#2 R14#2 = RC0603JR-0710KL: RES SMD 10K OHM 5% 1/10W 0603
R10#2 = TNPW06031K00BEEA: RES 1K OHM 0.1% 1/8W 0603; Manufacturer 1: Vishay Dale; Tolerance: 1%; Resistance: 1kR; Temperature Coefficient: 25ppm/°C; Power Rating: 100mW; Voltage Rating: 75V; Supplier 1: Digi-Key; Supplier Part Number 1: TNP1.00KAACT-ND; Manufacturer Part Number 1: TNPW06031K00BEEA; Stock 1: 92047; Pricing 1: 1=0.65000, 10=0.46200, 100=0.24020, 1000=0.12936, 2500=0.12760 (USD); RoHS: Yes; Mount: Surface Mount; Case/Package: 0603; Weight: 7.1E-05oz; Contact Plating: Tin; Case Code (Metric): 1608; Case Code (Imperial): 0603; Min Operating Temperature: -55°C; Max Operating Temperature: 125°C; Composition: Thin Film; Packaging: Tape and Reel; Package Quantity: 1; Number of Terminations: 2; Termination: SMD/SMT; Military Standard: Not; Max Power Dissipation: 100mW; Voltage Rating (DC): 75V; Features: Moisture Resistant,Automotive AEC-Q200,Anti-Sulfur; Length: 1.6mm; Height: 0.45mm; Width: 0.033inch; Depth: 0.85mm; Radiation Hardening: No; REACH SVHC: Unknown; Lead Free: Lead Free; ComponentLink1URL: https://datasheet.ciiva.com/2528/tnpw-e3-2528472.pdf?src-supplier=Digi-Key; ComponentLink1Description: https://datasheet.ciiva.com/2528/tnpw-e3-2528472.pdf?src-supplier=Digi-Key; ComponentLink2URL: https://datasheet.ciiva.com/2528/tnpw-e3-2528473.pdf?src-supplier=Digi-Key; ComponentLink2Description: https://datasheet.ciiva.com/2528/tnpw-e3-2528473.pdf?src-supplier=Digi-Key; ComponentLink3URL: https://datasheet.ciiva.com/9112/tnpw-e3-9112138.pdf?src-supplier=Avnet; ComponentLink3Description: https://datasheet.ciiva.com/9112/tnpw-e3-9112138.pdf?src-supplier=Avnet; ComponentLink4URL: https://datasheet.ciiva.com/16391/tnpw-e3-16391675.pdf?src-supplier=Future+Electronics; ComponentLink4Description: https://datasheet.ciiva.com/16391/tnpw-e3-16391675.pdf?src-supplier=Future+Electronics; ComponentLink5URL: https://datasheet.ciiva.com/9112/tnpw-e3-9112141.pdf?src-supplier=Avnet; ComponentLink5Description: https://datasheet.ciiva.com/9112/tnpw-e3-9112141.pdf?src-supplier=Avnet; ComponentLink6URL: https://datasheet.ciiva.com/16782/70201627-16782047.pdf?src-supplier=Allied+Electronics; ComponentLink6Description: https://datasheet.ciiva.com/16782/70201627-16782047.pdf?src-supplier=Allied+Electronics
TP3 = TP: 5029 SMD 0805 TP; Supplier 1: Digi-Key; Supplier Part Number 1: 36-5029CT-ND
U9 = ADAR7251

## Sheet XTAL.SchDoc
size A
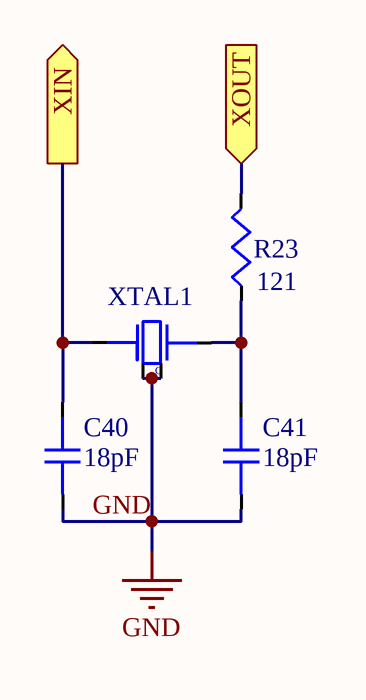
[diagram p3: XTAL.SchDoc]

### Parts
(Parts that share a designator on the sheet are numbered #1, #2 ... from top to bottom, then left to right.)
C40  18pF  [C0603]
C41  18pF  [C0603]
R23#2  121  [R0603]
XTAL1  ECS-192-12-33-AGM-TR  [XTAL_ECS-192-12-33-AGM-TR]  (value not drawn)

### Ports
XIN (out), XOUT (in)

### Nets
GND: C40.1 C41.1 XTAL1.2 XTAL1.4
XIN: C40.2 XTAL1.1 ; port XIN
XOUT: R23#2.2 ; port XOUT
NetC41_2: C41.2 R23#2.1 XTAL1.3

### Notes on the sheet
- (in symbol ECS-192-12-33-AGM-TR) G

### Library data of the parts
C40 C41 = 06035A190FAT2A: Multilayer Ceramic Capacitors MLCC - SMD/SMT 50V 18pF C0G 0603 1% Tol; Capacitance: 36pF; Supplier 1: Digi-Key; Supplier Part Number 1: 478-10293-1-ND; RoHS: Yes; Mount: Surface Mount; Case/Package: 0603; Case Code (Imperial): 0603; Case Code (Metric): 1608; Min Operating Temperature: -55°C; Max Operating Temperature: 125°C; Tolerance: 1%; Dielectric: C0G; Packaging: Tape and Reel; Package Quantity: 8000; Voltage Rating: 50V; Voltage Rating (DC): 50V; Termination: SMD/SMT; Length: 1.6mm; Depth: 0.81mm; Width: 0.81mm; Thickness: 0.035inch; Radiation Hardening: No; ComponentLink1URL: https://datasheet.ciiva.com/11567/ccog-11567927.pdf?src-supplier=Avnet; ComponentLink1Description: https://datasheet.ciiva.com/11567/ccog-11567927.pdf?src-supplier=Avnet; ComponentLink2URL: https://datasheet.ciiva.com/5423/ccog-243403-5423289.pdf?src-supplier=Mouser; ComponentLink2Description: https://datasheet.ciiva.com/5423/ccog-243403-5423289.pdf?src-supplier=Mouser; ComponentLink3URL: https://datasheet.ciiva.com/17492/ccog-17492554.pdf?src-supplier=Avnet+Europe; ComponentLink3Description: https://datasheet.ciiva.com/17492/ccog-17492554.pdf?src-supplier=Avnet+Europe; ComponentLink4URL: https://datasheet.ciiva.com/209/ccog-209692.pdf?src-supplier=Digi-Key; ComponentLink4Description: https://datasheet.ciiva.com/209/ccog-209692.pdf?src-supplier=Digi-Key
R23#2 = RP73PF1J121RBTDF: TE CONNECTIVITY         RP73PF1J121RBTDF             SMD Chip Resistor, Thin Film, 121 ohm, 100 V, 0603 [1608 Metric], 166 mW,  0.1%, RN73 Series; Resistance: 121R; Power Rating: 166mW; Voltage Rating: 100V; Max Power Dissipation: 167mW; Temperature Coefficient: 25ppm/°C; Supplier 1: Digi-Key; Supplier Part Number 1: A110020CT-ND; Manufacturer 1: TE Connectivity; Manufacturer Part Number 1: RP73PF1J121RBTDF; Stock 1: 850; Pricing 1: 1=0.66000, 10=0.48500, 100=0.28230 (USD); RoHS: Yes; Mount: Surface Mount; Case/Package: 0603; Case Code (Metric): 1608; Case Code (Imperial): 0603; Min Operating Temperature: -55°C; Max Operating Temperature: 155°C; Tolerance: 0.1%; Package Quantity: 1000; Packaging: Tape and Reel; Composition: Thin Film; Number of Terminations: 2; Termination: Solder; Voltage Rating (DC): 100V; Length: 0.061inch; Height: 0.022inch; Width: 0.031inch; Depth: 0.8mm; REACH SVHC: No SVHC; ComponentLink1URL: https://datasheet.ciiva.com/7801/1635325-7801605.pdf?src-supplier=Element14; ComponentLink1Description: https://datasheet.ciiva.com/7801/1635325-7801605.pdf?src-supplier=Element14; ComponentLink2URL: https://datasheet.ciiva.com/18601/eng-ds-1773272-j-18601303.pdf?src-supplier=Digi-Key; ComponentLink2Description: https://datasheet.ciiva.com/18601/eng-ds-1773272-j-18601303.pdf?src-supplier=Digi-Key; ComponentLink3URL: https://datasheet.ciiva.com/18601/eng-ds-1773272-j-18601304.pdf?src-supplier=Digi-Key; ComponentLink3Description: https://datasheet.ciiva.com/18601/eng-ds-1773272-j-18601304.pdf?src-supplier=Digi-Key; ComponentLink4URL: https://datasheet.ciiva.com/18601/eng-ds-1773272-j-18601305.pdf?src-supplier=Digi-Key; ComponentLink4Description: https://datasheet.ciiva.com/18601/eng-ds-1773272-j-18601305.pdf?src-supplier=Digi-Key
XTAL1 = ECS-192-12-33-AGM-TR: Crystal 19.2MHz ±25ppm (Tol) ±30ppm (Stability) 12pF FUND 80Ohm 4-Pin Mini-CSMD T/R; Manufacturer 1: ECS International; Supplier 1: Digi-Key; Supplier Part Number 1: XC2452CT-ND; Manufacturer Part Number 1: ECS-192-12-33-AGM-TR; Stock 1: 1382; Pricing 1: 1=0.56000, 10=0.46500, 50=0.41820, 100=0.37180, 500=0.35322 (USD)